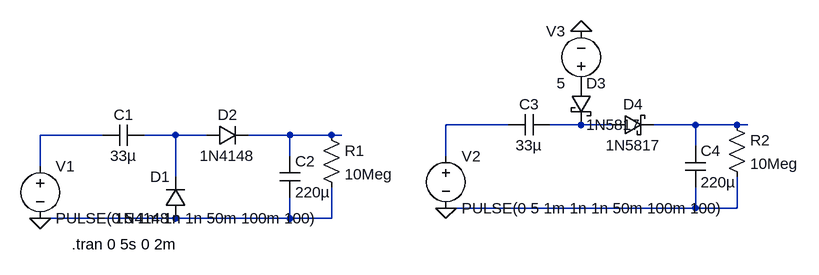
[diagram p0: schematic voltage-doubler.asc]
voltage-doubler.asc, the LTspice schematic file:
Version 4
SHEET 1 1140 680
WIRE 688 64 592 64
WIRE 800 64 752 64
WIRE 848 64 800 64
WIRE 976 64 912 64
WIRE 1040 64 976 64
WIRE 1056 64 1040 64
WIRE 64 80 -32 80
WIRE 176 80 128 80
WIRE 224 80 176 80
WIRE 352 80 288 80
WIRE 416 80 352 80
WIRE 432 80 416 80
WIRE 976 96 976 64
WIRE 352 112 352 80
WIRE 592 112 592 64
WIRE -32 128 -32 80
WIRE 176 144 176 80
WIRE 976 192 976 160
WIRE 976 192 592 192
WIRE 1040 192 1040 144
WIRE 1040 192 976 192
WIRE 176 208 -32 208
WIRE 352 208 352 176
WIRE 352 208 176 208
WIRE 416 208 416 160
WIRE 416 208 352 208
FLAG -32 208 0
FLAG 592 192 0
FLAG 800 -80 0
SYMBOL diode 192 208 R180
WINDOW 0 24 64 Left 2
WINDOW 3 24 0 Left 2
SYMATTR InstName D1
SYMATTR Value 1N4148
SYMBOL cap 128 64 R90
WINDOW 0 0 32 VBottom 2
WINDOW 3 32 32 VTop 2
SYMATTR InstName C1
SYMATTR Value 33µ
SYMBOL voltage -32 112 R0
WINDOW 123 0 0 Left 0
WINDOW 39 0 0 Left 0
SYMATTR InstName V1
SYMATTR Value PULSE(0 5 1m 1n 1n 50m 100m 100)
SYMBOL res 400 64 R0
SYMATTR InstName R1
SYMATTR Value 10Meg
SYMBOL cap 336 112 R0
SYMATTR InstName C2
SYMATTR Value 220µ
SYMBOL diode 224 96 R270
WINDOW 0 32 32 VTop 2
WINDOW 3 0 32 VBottom 2
SYMATTR InstName D2
SYMATTR Value 1N4148
SYMBOL schottky 784 0 R0
SYMATTR InstName D3
SYMATTR Value 1N5817
SYMATTR Description Diode
SYMATTR Type diode
SYMBOL cap 752 48 R90
WINDOW 0 0 32 VBottom 2
WINDOW 3 32 32 VTop 2
SYMATTR InstName C3
SYMATTR Value 33µ
SYMBOL voltage 592 96 R0
WINDOW 123 0 0 Left 0
WINDOW 39 0 0 Left 0
SYMATTR InstName V2
SYMATTR Value PULSE(0 5 1m 1n 1n 50m 100m 100)
SYMBOL res 1024 48 R0
SYMATTR InstName R2
SYMATTR Value 10Meg
SYMBOL cap 960 96 R0
SYMATTR InstName C4
SYMATTR Value 220µ
SYMBOL schottky 848 80 R270
WINDOW 0 32 32 VTop 2
WINDOW 3 0 32 VBottom 2
SYMATTR InstName D4
SYMATTR Value 1N5817
SYMATTR Description Diode
SYMATTR Type diode
SYMBOL voltage 800 16 R180
WINDOW 0 24 96 Left 2
WINDOW 3 24 16 Left 2
SYMATTR InstName V3
SYMATTR Value 5
TEXT 16 248 Left 2 !.tran 0 5s 0 2m

The netlist it stands for:
* voltage-doubler.asc
D1 0 N005 1N4148
C1 N005 N004 33µ
V1 N004 0 PULSE(0 5 1m 1n 1n 50m 100m 100)
R1 N006 0 10Meg
C2 N006 0 220µ
D2 N005 N006 1N4148
D3 P001 N002 1N5817
C3 N002 N001 33µ
V2 N001 0 PULSE(0 5 1m 1n 1n 50m 100m 100)
R2 N003 0 10Meg
C4 N003 0 220µ
D4 N002 N003 1N5817
V3 P001 0 5
.model D D
.lib standard.dio
.tran 0 5s 0 2m
.backanno
.end